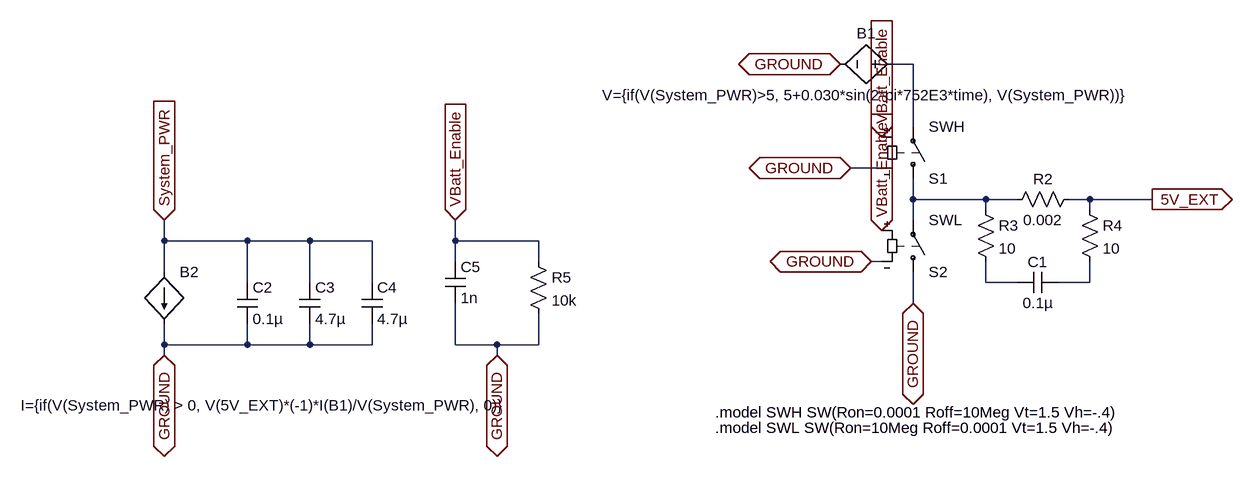
[diagram p0: schematic 5V_EXT.asc]
5V_EXT.asc, the LTspice schematic file:
Version 4
SHEET 1 2004 680
WIRE 480 -144 448 -144
WIRE 480 -48 480 -144
WIRE 432 16 384 16
WIRE 480 64 480 32
WIRE 592 64 480 64
WIRE 640 64 592 64
WIRE 752 64 720 64
WIRE 848 64 752 64
WIRE 592 80 592 64
WIRE 752 80 752 64
WIRE 480 96 480 64
WIRE -672 128 -672 96
WIRE -544 128 -672 128
WIRE -448 128 -544 128
WIRE -352 128 -448 128
WIRE -224 128 -224 96
WIRE -96 128 -224 128
WIRE -224 160 -224 128
WIRE -96 160 -96 128
WIRE 432 160 416 160
WIRE -672 176 -672 128
WIRE -544 192 -544 128
WIRE -448 192 -448 128
WIRE -352 192 -352 128
WIRE 592 192 592 160
WIRE 640 192 592 192
WIRE 752 192 752 160
WIRE 752 192 704 192
WIRE 480 224 480 176
WIRE -672 288 -672 256
WIRE -544 288 -544 256
WIRE -544 288 -672 288
WIRE -448 288 -448 256
WIRE -448 288 -544 288
WIRE -352 288 -352 256
WIRE -352 288 -448 288
WIRE -224 288 -224 224
WIRE -160 288 -224 288
WIRE -96 288 -96 240
WIRE -96 288 -160 288
WIRE -672 304 -672 288
WIRE -160 304 -160 288
FLAG 848 64 5V_EXT
IOPIN 848 64 Out
FLAG -672 96 System_PWR
IOPIN -672 96 In
FLAG 432 -32 VBatt_Enable
IOPIN 432 -32 In
FLAG 432 112 VBatt_Enable
IOPIN 432 112 In
FLAG -224 96 VBatt_Enable
IOPIN -224 96 In
FLAG 368 -144 GROUND
IOPIN 368 -144 BiDir
FLAG 384 16 GROUND
IOPIN 384 16 BiDir
FLAG 416 160 GROUND
IOPIN 416 160 BiDir
FLAG 480 224 GROUND
IOPIN 480 224 BiDir
FLAG -160 304 GROUND
IOPIN -160 304 BiDir
FLAG -672 304 GROUND
IOPIN -672 304 BiDir
SYMBOL bv 464 -144 R90
WINDOW 0 -32 56 VBottom 2
WINDOW 3 32 56 VTop 2
SYMATTR InstName B1
SYMATTR Value V={if(V(System_PWR)>5, 5+0.030*sin(2*pi*752E3*time), V(System_PWR))}
SYMBOL bi -672 176 R0
WINDOW 3 527 205 Right 2
SYMATTR Value I={if(V(System_PWR) > 0, V(5V_EXT)*(-1)*I(B1)/V(System_PWR), 0)}
SYMATTR InstName B2
SYMBOL sw 480 48 M180
SYMATTR InstName S1
SYMATTR Value SWH
SYMBOL sw 480 192 M180
SYMATTR InstName S2
SYMATTR Value SWL
SYMBOL res 624 80 R270
WINDOW 0 32 56 VTop 2
WINDOW 3 0 56 VBottom 2
SYMATTR InstName R2
SYMATTR Value 0.002
SYMBOL res 576 64 R0
SYMATTR InstName R3
SYMATTR Value 10
SYMBOL res 736 64 R0
SYMATTR InstName R4
SYMATTR Value 10
SYMBOL cap 704 176 R90
WINDOW 0 0 32 VBottom 2
WINDOW 3 32 32 VTop 2
SYMATTR InstName C1
SYMATTR Value 0.1µ
SYMBOL cap -560 192 R0
SYMATTR InstName C2
SYMATTR Value 0.1µ
SYMBOL cap -464 192 R0
SYMATTR InstName C3
SYMATTR Value 4.7µ
SYMBOL cap -368 192 R0
SYMATTR InstName C4
SYMATTR Value 4.7µ
SYMBOL cap -240 160 R0
SYMATTR InstName C5
SYMATTR Value 1n
SYMBOL res -112 144 R0
SYMATTR InstName R5
SYMATTR Value 10k
TEXT 176 392 Left 2 !.model SWH SW(Ron=0.0001 Roff=10Meg Vt=1.5 Vh=-.4)
TEXT 176 416 Left 2 !.model SWL SW(Ron=10Meg Roff=0.0001 Vt=1.5 Vh=-.4)

The netlist it stands for:
* 5V_EXT.asc
B1 N001 GROUND V={if(V(System_PWR)>5, 5+0.030*sin(2*pi*752E3*time), V(System_PWR))}
B2 System_PWR GROUND I={if(V(System_PWR) > 0, V(5V_EXT)*(-1)*I(B1)/V(System_PWR), 0)}
S1 N002 N001 VBatt_Enable GROUND SWH
S2 GROUND N002 VBatt_Enable GROUND SWL
R2 N002 5V_EXT 0.002
R3 N002 N003 10
R4 5V_EXT N004 10
C1 N004 N003 0.1µ
C2 System_PWR GROUND 0.1µ
C3 System_PWR GROUND 4.7µ
C4 System_PWR GROUND 4.7µ
C5 VBatt_Enable GROUND 1n
R5 VBatt_Enable GROUND 10k
.model SWH SW(Ron=0.0001 Roff=10Meg Vt=1.5 Vh=-.4)
.model SWL SW(Ron=10Meg Roff=0.0001 Vt=1.5 Vh=-.4)
.backanno
.end